# EAGLE design RGB_POI_STICK (EAGLE 5.11)

## Sheet 1 of 3
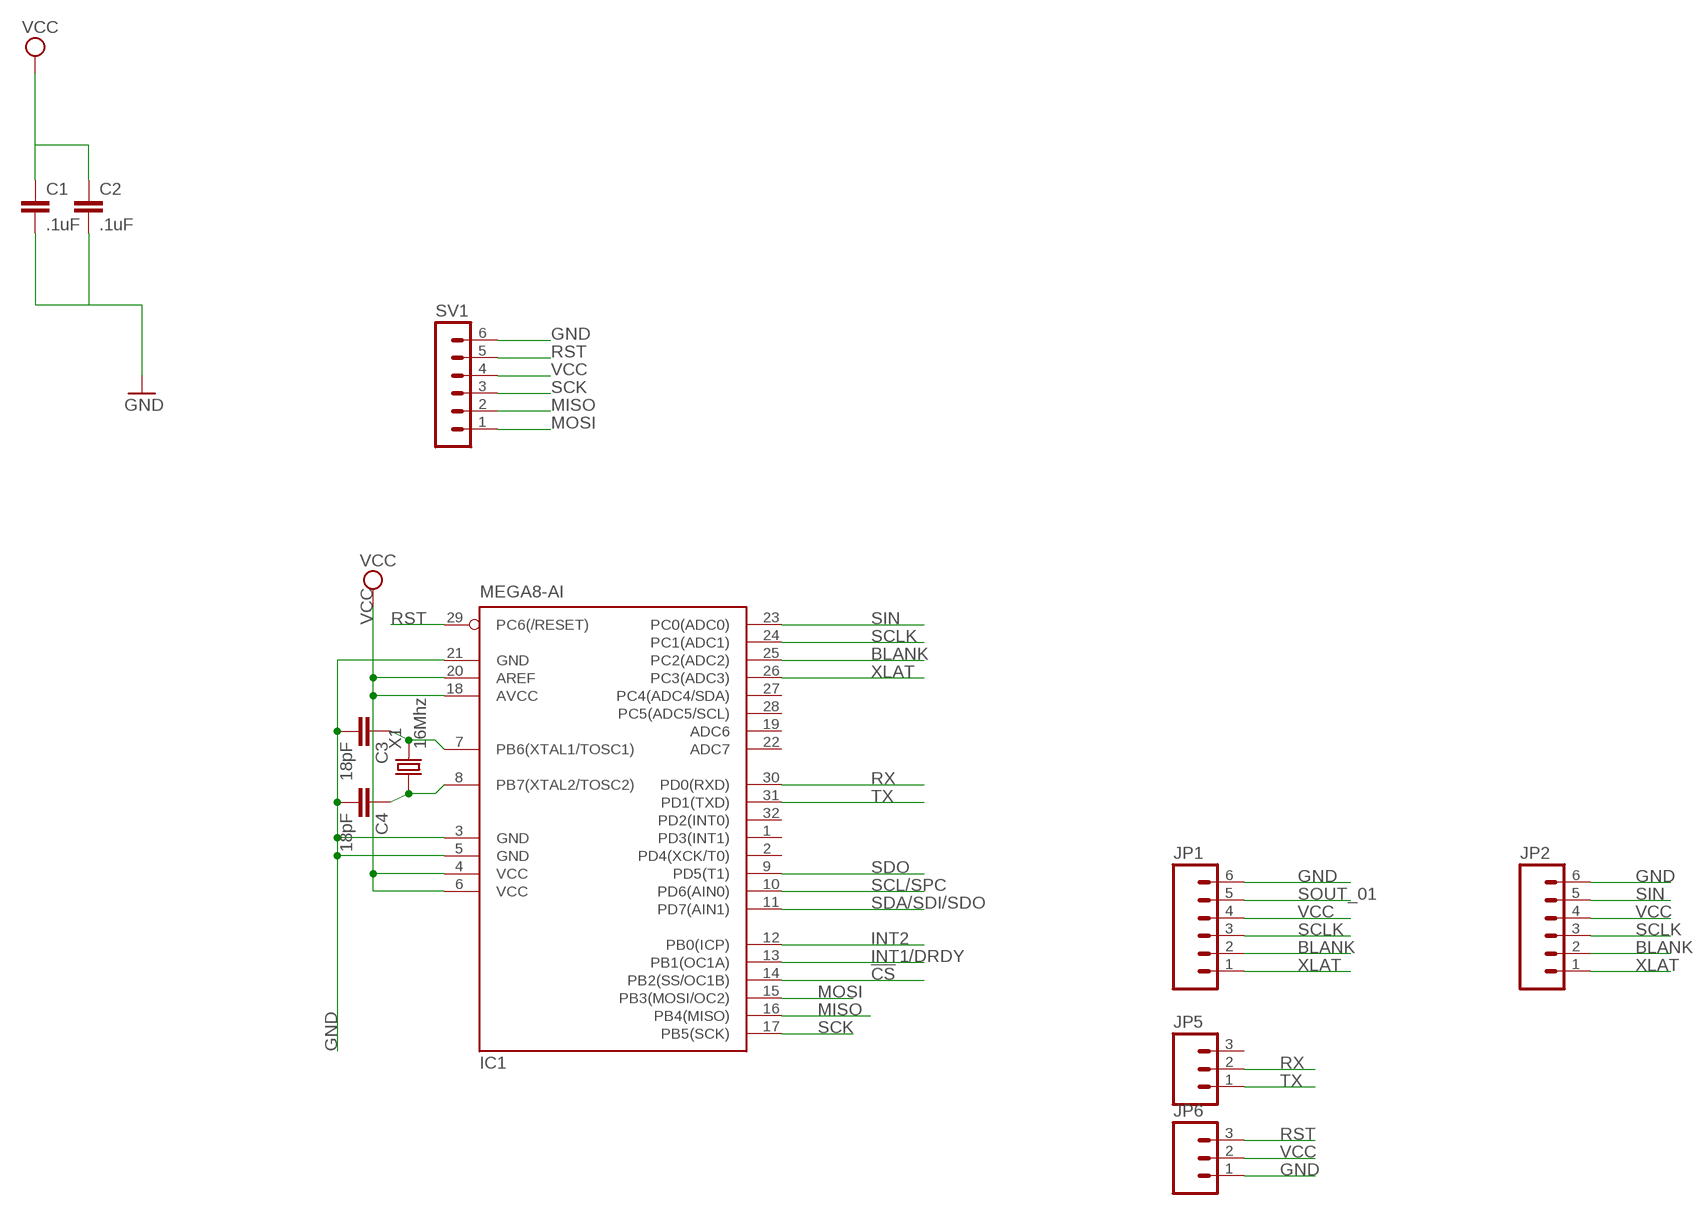
[diagram p0: schematic, sheet 1]

### Parts
C1  .1uF  CAP0805  [0805]
C2  .1uF  CAP0805  [0805]
C3  18pF  CAP0805  [0805]
C4  18pF  CAP0805  [0805]
IC1  MEGA8-AI  [TQFP32-08]
JP1  M06SIP  [1X06]
JP2  M06SIP  [1X06]
JP5  M03PTH  [1X03]
JP6  M03PTH  [1X03]
SV1  MA06-1  [MA06-1]
X1  16Mhz  CRYSTAL-5032  [5032]

### Nets
!CS: IC1.14(PB2(SS/OC1B))
BLANK: IC1.25(PC2(ADC2)) JP1.2 JP2.2 ; also sheet 2
GND: C1.2 C2.2 C3.2 C4.2 IC1.3(GND) IC1.5(GND) IC1.21(GND) JP1.6 JP2.6 JP6.1 SV1.6 ; also sheet 2
INT1/DRDY: IC1.13(PB1(OC1A))
INT2: IC1.12(PB0(ICP))
MISO: IC1.16(PB4(MISO)) SV1.2
MOSI: IC1.15(PB3(MOSI/OC2)) SV1.1
N$7: C3.1 IC1.7(PB6(XTAL1/TOSC1)) X1.2
N$8: C4.1 IC1.8(PB7(XTAL2/TOSC2)) X1.1
RST: IC1.29(PC6(/RESET)) JP6.3 SV1.5
RX: IC1.30(PD0(RXD)) JP5.2
SCK: IC1.17(PB5(SCK)) SV1.3
SCL/SPC: IC1.10(PD6(AIN0))
SCLK: IC1.24(PC1(ADC1)) JP1.3 JP2.3 ; also sheet 2
SDA/SDI/SDO: IC1.11(PD7(AIN1))
SDO: IC1.9(PD5(T1))
SIN: IC1.23(PC0(ADC0)) JP2.5 ; also sheet 2
SOUT_01: JP1.5 ; also sheet 2
TX: IC1.31(PD1(TXD)) JP5.1
VCC: C1.1 C2.1 IC1.4(VCC) IC1.6(VCC) IC1.18(AVCC) IC1.20(AREF) JP1.4 JP2.4 JP6.2 SV1.4 ; also sheet 2,3
XLAT: IC1.26(PC3(ADC3)) JP1.1 JP2.1 ; also sheet 2
Unconnected: IC1.1(PD3(INT1)) IC1.2(PD4(XCK/T0)) IC1.19(ADC6) IC1.22(ADC7) IC1.27(PC4(ADC4/SDA)) IC1.28(PC5(ADC5/SCL)) IC1.32(PD2(INT0)) JP5.3

## Sheet 2 of 3
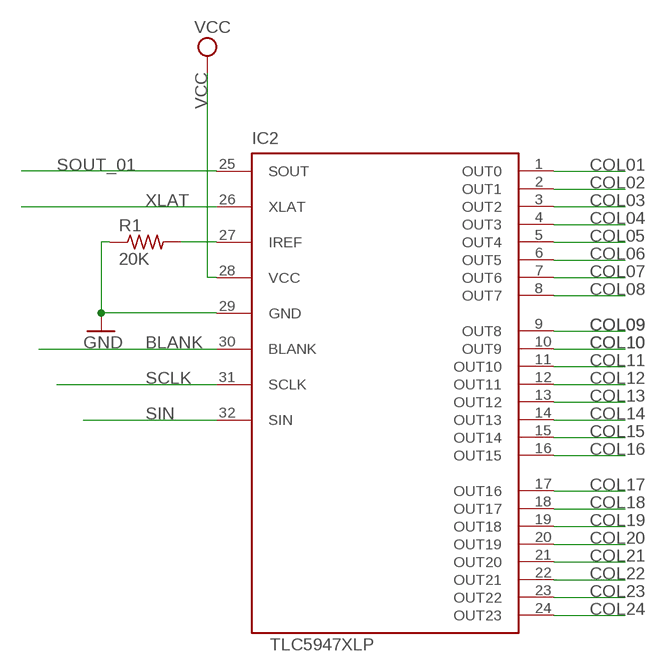
[diagram p1: schematic, sheet 2]

### Parts
IC2  TLC5947XLP  [QFN32_XLP]
R1  20K  R-US_R0805  [R0805]

### Nets
BLANK: IC2.30(BLANK) ; also sheet 1
COL01: IC2.1(OUT0) ; also sheet 3
COL02: IC2.2(OUT1) ; also sheet 3
COL03: IC2.3(OUT2) ; also sheet 3
COL04: IC2.4(OUT3) ; also sheet 3
COL05: IC2.5(OUT4) ; also sheet 3
COL06: IC2.6(OUT5) ; also sheet 3
COL07: IC2.7(OUT6) ; also sheet 3
COL08: IC2.8(OUT7) ; also sheet 3
COL09: IC2.9(OUT8) ; also sheet 3
COL10: IC2.10(OUT9) ; also sheet 3
COL11: IC2.11(OUT10) ; also sheet 3
COL12: IC2.12(OUT11) ; also sheet 3
COL13: IC2.13(OUT12) ; also sheet 3
COL14: IC2.14(OUT13) ; also sheet 3
COL15: IC2.15(OUT14) ; also sheet 3
COL16: IC2.16(OUT15) ; also sheet 3
COL17: IC2.17(OUT16) ; also sheet 3
COL18: IC2.18(OUT17) ; also sheet 3
COL19: IC2.19(OUT18) ; also sheet 3
COL20: IC2.20(OUT19) ; also sheet 3
COL21: IC2.21(OUT20) ; also sheet 3
COL22: IC2.22(OUT21) ; also sheet 3
COL23: IC2.23(OUT22) ; also sheet 3
COL24: IC2.24(OUT23) ; also sheet 3
GND: IC2.29(GND) R1.1 ; also sheet 1
N$1: IC2.27(IREF) R1.2
SCLK: IC2.31(SCLK) ; also sheet 1
SIN: IC2.32(SIN) ; also sheet 1
SOUT_01: IC2.25(SOUT) ; also sheet 1
VCC: IC2.28(VCC) ; also sheet 1,3
XLAT: IC2.26(XLAT) ; also sheet 1

## Sheet 3 of 3
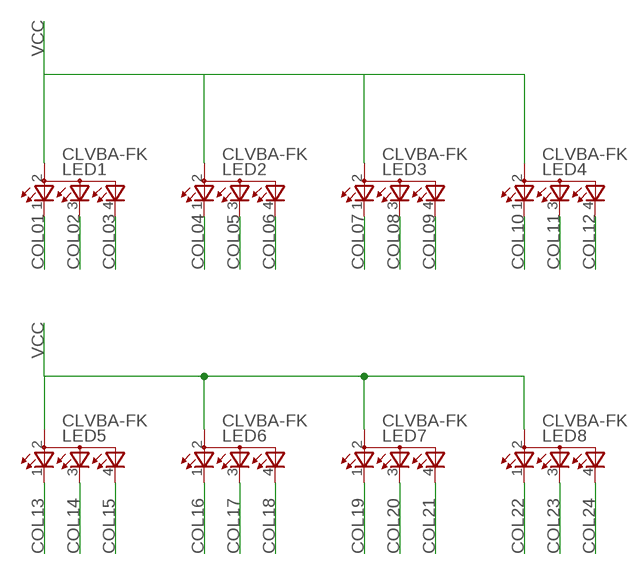
[diagram p2: schematic, sheet 3]

### Parts
LED1  CLVBA-FK  [PLCC4]
LED2  CLVBA-FK  [PLCC4]
LED3  CLVBA-FK  [PLCC4]
LED4  CLVBA-FK  [PLCC4]
LED5  CLVBA-FK  [PLCC4]
LED6  CLVBA-FK  [PLCC4]
LED7  CLVBA-FK  [PLCC4]
LED8  CLVBA-FK  [PLCC4]

### Nets
COL01: LED1.1(CRED) ; also sheet 2
COL02: LED1.3(CBLUE) ; also sheet 2
COL03: LED1.4(CGREEN) ; also sheet 2
COL04: LED2.1(CRED) ; also sheet 2
COL05: LED2.3(CBLUE) ; also sheet 2
COL06: LED2.4(CGREEN) ; also sheet 2
COL07: LED3.1(CRED) ; also sheet 2
COL08: LED3.3(CBLUE) ; also sheet 2
COL09: LED3.4(CGREEN) ; also sheet 2
COL10: LED4.1(CRED) ; also sheet 2
COL11: LED4.3(CBLUE) ; also sheet 2
COL12: LED4.4(CGREEN) ; also sheet 2
COL13: LED5.1(CRED) ; also sheet 2
COL14: LED5.3(CBLUE) ; also sheet 2
COL15: LED5.4(CGREEN) ; also sheet 2
COL16: LED6.1(CRED) ; also sheet 2
COL17: LED6.3(CBLUE) ; also sheet 2
COL18: LED6.4(CGREEN) ; also sheet 2
COL19: LED7.1(CRED) ; also sheet 2
COL20: LED7.3(CBLUE) ; also sheet 2
COL21: LED7.4(CGREEN) ; also sheet 2
COL22: LED8.1(CRED) ; also sheet 2
COL23: LED8.3(CBLUE) ; also sheet 2
COL24: LED8.4(CGREEN) ; also sheet 2
VCC: LED1.2(A2) LED2.2(A2) LED3.2(A2) LED4.2(A2) LED5.2(A2) LED6.2(A2) LED7.2(A2) LED8.2(A2) ; also sheet 1,2

## Library data of the parts
C1-C4 = slice_noshift:CAP: Capacitor Standard 0603 ceramic capacitor, and 0.1" leaded capacitor.
IC1 = atmel:MEGA8: MICROCONTROLLER 8 Kbytes FLASH, 1 kbytes SRAM, 512 bytes EEPROM, USART, 6-channel 10 bit ADC, 2-channel 8 bit ADC Pin compatible with Atmega48, ATMega88, ATMega168 Source: avr.lbr; MPN: ATMEGA8-16AU; OC_FARNELL: 9171371; OC_NEWARK: 73M8863
IC2 = slice_noshift:TLC5947
JP1 JP2 = SparkFun:M06: Header 6 Standard 6-pin 0.1" header. Use with straight break away headers (SKU : PRT-00116), right angle break away headers (PRT-00553), swiss pins (PRT-00743), machine pins (PRT-00117), and female headers (PRT-00115). Molex polarized connector foot print use with SKU : PRT-08094 with associated crimp pins and housings. NOTES ON THE VARIANTS LOCK and LOCK_LONGPADS... This footprint was designed to help hold the alignment of a through-hole component (i.e. 6-pin header) while soldering it into place. You may notice that each hole has been shifted either up or down by 0.005 of an inch from it's more standard position (which is a perfectly straight line). This slight alteration caused the pins (the squares in the middle) to touch the edges of the holes. Because they are alternating, it causes a "brace" to hold the component in place. 0.005 has proven to be the perfect amount of "off-center" position when using our standard breakaway headers. Although looks a little odd when you look at the bare footprint, once you have a header in there, the alteration is very hard to notice. Also, if you push a header all the way into place, it is covered up entirely on the bottom side. This idea of altering the position of holes to aid alignment will be further integrated into the Sparkfun Library for other footprints. It can help hold any component with 3 or more connection pins.
JP5 JP6 = SparkFun:M03: Header 3 Standard 3-pin 0.1" header. Use with straight break away headers (SKU : PRT-00116), right angle break away headers (PRT-00553), swiss pins (PRT-00743), machine pins (PRT-00117), and female headers (PRT-00115). Molex polarized connector foot print use with SKU : PRT-08232 with associated crimp pins and housings.
LED1-LED8 = rf_blinky:CLVBA-FK
R1 = rcl:R-US_: RESISTOR, American symbol
SV1 = NSL:MA06-1: PIN HEADER
X1 = NSL_MiniQuad:CRYSTAL*: CRYSTAL

## Board
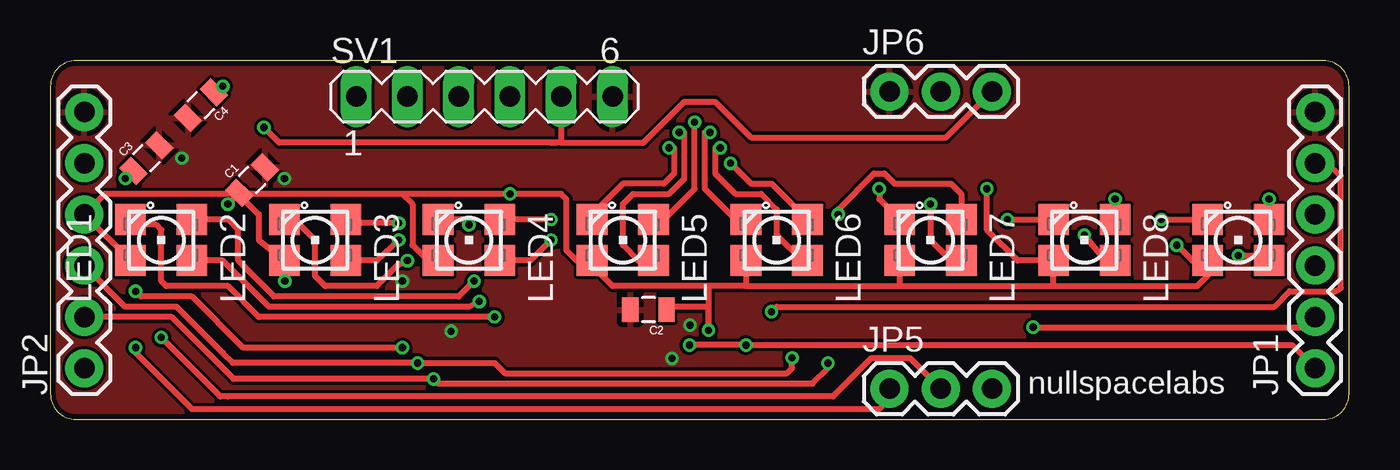
[diagram p3: board, top side]
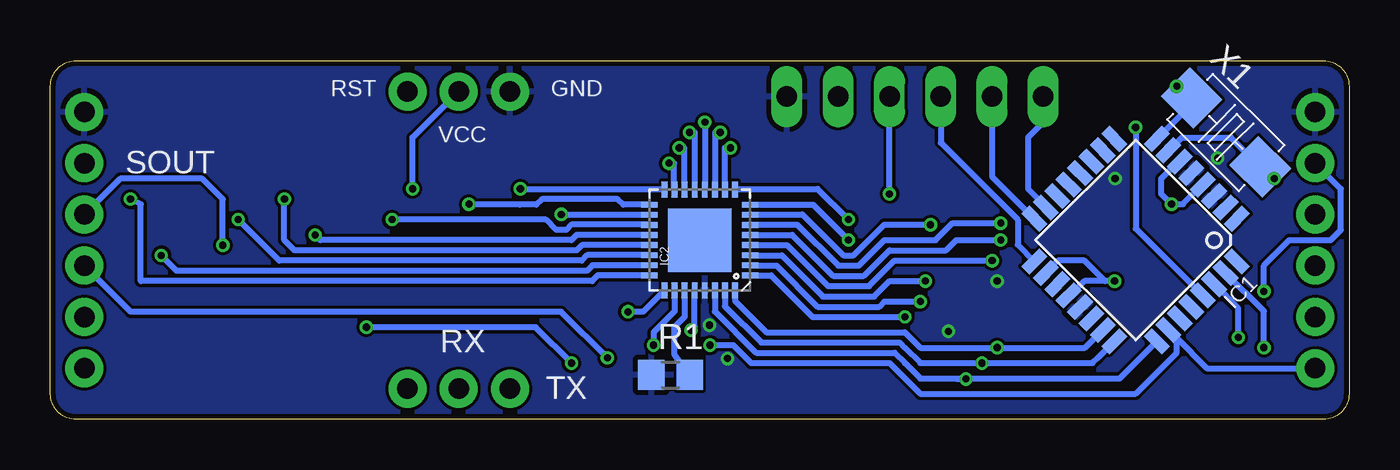
[diagram p4: board, bottom side, seen from below]

Size 64.31 x 17.78 mm. Coordinates in mm from the lower left corner, seen from the top.
Outline: 64.31,16.51 arc90 63.04,17.78 1.27,17.78 arc90 0,16.51 0,1.27 arc90 1.27,0 63.04,0 arc90 64.31,1.27 64.31,16.51
Copper layers (1*16): Top 0.035mm / dielectric 1.5mm / Bottom 0.035mm
Design rules "ITead_rule": minimum track width 6mil, minimum drill 12mil, track to track 6mil, track to pad 6mil, pad to pad 6mil, via to via 6mil, smd to smd 0mil, copper to edge 10mil, drill to drill 10mil, minimum pad ring 10mil, minimum via ring 6mil, stop-mask expansion 2mil, vias tented up to drill 100mil, thermal gap 10mil

### Footprints (pad centres in the part's own frame; a part is rotated, then mirrored left to right if it is on the bottom)
0805 = smd 0.8 x 1.2: 1 -0.9,0; 2 0.9,0
TQFP32-08 = smd 1.27 x 0.559: 1 -4.293,2.8; 2 -4.293,2; 3 -4.293,1.2; 4 -4.293,0.4; 5 -4.293,-0.4; 6 -4.293,-1.2; 7 -4.293,-2; 8 -4.293,-2.8; 17 4.293,-2.8; 18 4.293,-2; 19 4.293,-1.2; 20 4.293,-0.4; 21 4.293,0.4; 22 4.293,1.2; 23 4.293,2; 24 4.293,2.8 | smd 0.559 x 1.27: 9 -2.8,-4.293; 10 -2,-4.293; 11 -1.2,-4.293; 12 -0.4,-4.293; 13 0.4,-4.293; 14 1.2,-4.293; 15 2,-4.293; 16 2.8,-4.293; 25 2.8,4.293; 26 2,4.293; 27 1.2,4.293; 28 0.4,4.293; 29 -0.4,4.293; 30 -1.2,4.293; 31 -2,4.293; 32 -2.8,4.293
QFN32_XLP = smd 0.285 x 0.8: 1 -1.75,-2.5; 2 -1.25,-2.5; 3 -0.75,-2.5; 4 -0.25,-2.5; 5 0.25,-2.5; 6 0.75,-2.5; 7 1.25,-2.5; 8 1.75,-2.5; 17 1.75,2.5; 18 1.25,2.5; 19 0.75,2.5; 20 0.25,2.5; 21 -0.25,2.5; 22 -0.75,2.5; 23 -1.25,2.5; 24 -1.75,2.5 | smd 0.8 x 0.285: 9 2.5,-1.75; 10 2.5,-1.25; 11 2.5,-0.75; 12 2.5,-0.25; 13 2.5,0.25; 14 2.5,0.75; 15 2.5,1.25; 16 2.5,1.75; 25 -2.5,1.75; 26 -2.5,1.25; 27 -2.5,0.75; 28 -2.5,0.25; 29 -2.5,-0.25; 30 -2.5,-0.75; 31 -2.5,-1.25; 32 -2.5,-1.75 | smd 3.15 x 3.15: EP 0,0
1X06 = drill 1.016 pad 1.88 round: 1 0,0; 2 2.54,0; 3 5.08,0; 4 7.62,0; 5 10.16,0; 6 12.7,0
1X03 = drill 1.016 pad 1.88 round: 1 0,0; 2 2.54,0; 3 5.08,0
PLCC4 = smd 1.524 x 1.524: 1 -1.524,1.016; 2 -1.524,-1.016; 3 1.524,-1.016; 4 1.524,1.016
R0805 = smd 1.3 x 1.5: 1 -0.95,0; 2 0.95,0
MA06-1 = drill 1.016 long: 1 -6.35,0; 2 -3.81,0; 3 -1.27,0; 4 1.27,0; 5 3.81,0; 6 6.35,0
5032 = smd 2.286 x 2.032: 1 -2.413,0; 2 2.413,0

### Placement (x,y rotation side)
C1  9.98,11.86 45 top
C2  29.62,5.44 180 top
C3  4.75,12.95 45 top
C4  7.45,15.58 225 top
IC1  10.57,8.89 225 bottom
IC2  32.16,8.89 90 bottom
JP1  62.64,2.54 90 top
JP2  1.68,2.54 90 top
JP5  41.55,1.52 0 top
JP6  41.55,16.26 0 top
LED1  5.49,8.89 0 top
LED2  13.11,8.89 0 top
LED3  20.73,8.89 0 top
LED4  28.35,8.89 0 top
LED5  35.97,8.89 0 top
LED6  43.59,8.89 0 top
LED7  51.21,8.89 0 top
LED8  58.83,8.89 0 top
R1  33.61,2.21 0 bottom
SV1  21.49,16 0 top
X1  6.1,14.22 315 bottom

### Tracks (layer width: path | path; a pad name or v marks a point on that pad's centre or on a via)
BLANK  (via drill 0.36)
  Top 0.305: JP2.2 5.99,5.08 9.07,2.01 v18.97,2.01 19.2,1.78 37.74,1.78 38.51,2.54 v38.51,2.79 | JP1.2 62.89,5.08 62.38,4.57 v48.67,4.57
  Bottom 0.305: IC2.30 31.41,5.35 29.36,3.3 22.5,3.3 22,2.79 21.23,2.03 19.46,2.03 | 9.51,3.85 IC1.25 11.35,2.03 18.44,2.03 19.46,2.03 | v38.51,2.79 40.28,4.57 v48.67,4.57 | 19.46,2.03 19.43,2.01 v18.97,2.01
COL01  (via drill 0.36)
  Top 0.305: v22,5.08 10.31,5.08 8.79,6.6 5.74,6.6 5.49,6.86 5.49,9.4 5.23,9.65 4.22,9.65 LED1.1
  Bottom 0.305: IC2.1 28.63,7.14 26.57,5.08 v22,5.08
COL02  (via drill 0.36)
  Top 0.305: v21.23,5.84 20.73,5.59 10.82,5.59 8.53,7.87 LED1.3
  Bottom 0.305: IC2.2 29.64,7.62 28.35,7.62 26.31,5.59 23.27,5.59 23.01,5.84 v21.23,5.84
COL03  (via drill 0.36)
  Top 0.305: v20.98,6.86 20.22,6.1 11.07,6.1 9.3,7.87 9.3,9.4 8.79,9.91 LED1.4
  Bottom 0.305: IC2.3 29.64,8.13 28.09,8.13 26.06,6.1 23.52,6.1 22.76,6.86 v20.98,6.86
COL04  (via drill 0.36)
  Top 0.305: LED2.1 12.09,9.91 13.11,8.89 13.11,7.37 13.11,7.11 13.61,6.6 16.15,6.6 17.17,7.62 v17.68,7.87
  Bottom 0.305: IC2.4 27.84,8.64 25.81,6.6 23.77,6.6 22.5,7.87 v17.68,7.87
COL05  (via drill 0.36)
  Top 0.305: v17.25,8.89 16.15,7.87 LED2.3
  Bottom 0.305: IC2.5 27.58,9.14 25.55,7.11 24.03,7.11 22.76,8.38 19.96,8.38 19.46,8.89 v17.25,8.89
COL06  (via drill 0.36)
  Top 0.305: LED2.4 14.81,9.73 v17.25,9.73
  Bottom 0.305: IC2.6 29.64,9.65 27.33,9.65 25.3,7.62 24.28,7.62 23.01,8.89 20.47,8.89 19.63,9.73 v17.25,9.73
COL07  (via drill 0.36)
  Top 0.305: v20.73,9.65 20.47,9.91 LED3.1
  Bottom 0.305: IC2.7 29.64,10.16 27.08,10.16 25.04,8.13 24.54,8.13 23.01,9.65 v20.73,9.65
COL08  (via drill 0.36)
  Top 0.305: v24.79,8.89 23.77,7.87 LED3.3
  Bottom 0.305: IC2.8 26.54,10.64 v24.79,8.89
COL09  (via drill 0.36)
  Top 0.305: v24.79,9.91 LED3.4
  Bottom 0.305: v24.79,9.91 26.31,11.43 30.37,11.43 IC2.9
COL10  (via drill 0.36)
  Top 0.305: v30.63,13.46 30.89,13.46 30.89,12.19 30.38,11.68 28.35,11.68 26.82,10.16 LED4.1
  Bottom 0.305: IC2.10 30.91,13.46 v30.63,13.46
COL11  (via drill 0.36)
  Top 0.305: v31.14,14.22 31.39,14.22 31.39,11.94 30.63,11.18 28.85,11.18 28.35,10.67 28.35,8.64 29.11,7.87 LED4.3
  Bottom 0.305: IC2.11 31.39,11.4 31.39,14.22 v31.14,14.22
COL12  (via drill 0.36)
  Top 0.305: v31.9,14.73 31.9,11.43 30.38,9.91 LED4.4
  Bottom 0.305: IC2.12 v31.9,14.73
COL13  (via drill 0.36)
  Top 0.305: v32.66,14.22 32.41,14.22 32.41,11.43 33.93,9.91 LED5.1
  Bottom 0.305: IC2.13 32.41,14.22 v32.66,14.22
COL14  (via drill 0.36)
  Top 0.305: v33.17,13.46 32.92,13.46 32.92,12.19 33.93,11.18 35.2,11.18 35.97,10.41 35.97,9.14 37.24,7.87 LED5.3
  Bottom 0.305: IC2.14 32.92,11.4 32.92,13.46 v33.17,13.46
COL15  (via drill 0.36)
  Top 0.305: LED5.4 35.71,11.68 34.7,11.68 v33.68,12.7
  Bottom 0.305: IC2.15 33.43,11.41 33.43,12.7 v33.68,12.7
COL16  (via drill 0.36)
  Top 0.305: v41.05,11.43 41.05,10.92 LED6.1
  Bottom 0.305: IC2.16 41.01,11.39 v41.05,11.43
COL17  (via drill 0.36)
  Top 0.305: 44.86,8.13 LED6.3 44.6,7.87 43.59,8.89 v43.59,10.67
  Bottom 0.305: v43.59,10.67 43.56,10.64 41.07,10.64 40.26,10.64 39.97,10.92 36.22,10.92 35.94,10.64 IC2.17
COL18  (via drill 0.36)
  Top 0.305: v39.01,10.16 39.01,10.41 40.79,12.19 41.3,12.19 41.81,11.68 44.6,11.68 45.11,11.18 LED6.4
  Bottom 0.305: IC2.18 38.99,10.14 v39.01,10.16
COL19  (via drill 0.36)
  Top 0.305: v47.4,9.91 LED7.1
  Bottom 0.305: IC2.19 34.67,9.65 38.51,9.65 38.76,9.4 39.27,9.4 39.78,9.91 v47.4,9.91
COL20  (via drill 0.36)
  Top 0.305: v51.21,9.14 52.22,7.87 LED7.3
  Bottom 0.305: IC2.20 38.25,9.14 38.51,8.89 50.95,8.89 v51.21,9.14
COL21  (via drill 0.36)
  Top 0.305: v52.73,10.92 LED7.4
  Bottom 0.305: IC2.21 38,8.64 38.25,8.38 50.7,8.38 52.22,8.38 52.73,8.89 v52.73,10.92
COL22  (via drill 0.36)
  Top 0.305: v55.02,9.91 LED8.1
  Bottom 0.305: IC2.22 37.73,8.14 38,7.87 52.98,7.87 v55.02,9.91
COL23  (via drill 0.36)
  Top 0.305: v58.83,8.13 60.1,8.13 LED8.3
  Bottom 0.305: IC2.23 37.47,7.64 37.74,7.37 58.06,7.37 v58.83,8.13
COL24  (via drill 0.36)
  Top 0.305: v60.35,10.92 LED8.4
  Bottom 0.305: IC2.24 37.21,7.14 37.49,6.86 59.84,6.86 59.84,10.67 v60.35,10.92
GND  (via drill 0.36)
  other vias: 31.67,4.67 17.42,6.86 11.58,11.94 6.5,12.95 19.84,4.37 30.78,3.02
  pour Bottom: -1.37,19.05 64.92,19.3 64.92,-1.02 -1.37,-1.27
  pour Top: -0.36,18.29 64.67,18.29 64.67,-0.25 -0.36,-0.25
MISO
  Bottom 0.305: IC1.16 17.68,12.04 SV1.2
MOSI
  Bottom 0.305: IC1.15 15.02,10.55 15.9,11.43 15.9,13.97 15.14,14.73 SV1.1
N$1
  Bottom 0.305: IC2.27 | IC2.27 32.92,6.38 | IC2.27 32.91,5.09 33.43,4.57 33.43,3.3 33.43,3.24 R1.2
N$7  (via drill 0.36)
  Top 0.305: C3.1 4.09,12.32 v3.71,11.94
  Bottom 0.305: IC1.7 8.91,13.34 8.28,13.97 5.85,13.97 X1.2 3.81,11.94 v3.71,11.94
N$8  (via drill 0.36)
  Top 0.305: C4.1 8.24,16.22 v8.53,16.51
  Bottom 0.305: IC1.8 7.81,15.61 X1.1 8.39,16.51 v8.53,16.51
RST  (via drill 0.36)
  Top 0.305: v10.57,14.48 11.33,13.72 24.79,13.72 | 24.79,13.72 25.04,13.72 | JP6.3 44.35,13.97 34.7,13.97 32.92,15.75 31.39,15.75 29.36,13.72 25.3,13.72 | 25.3,13.72 24.79,13.72 | SV1.5 25.3,13.72
  Bottom 0.305: IC1.29 10.57,9.46 v10.57,14.48
RX  (via drill 0.36)
  Top 0.305: JP5.2 42.57,3.05 40.67,3.05 38.76,1.14 8.79,1.14 8.41,1.14 v5.49,4.06
  Bottom 0.305: IC1.30 5.49,5.51 v5.49,4.06
SCK
  Bottom 0.305: IC1.17 16.41,8.66 16.41,9.91 20.22,13.72 SV1.3
SCLK  (via drill 0.36)
  Top 0.305: JP2.3 3.71,5.59 6.25,5.59 8.53,3.3 9.04,2.79 v18.19,2.79 22,2.79 22.5,2.29 36.47,2.29 36.73,2.54 v36.73,3.05
  Bottom 0.305: IC2.31 30.91,5.61 30.89,5.59 29.11,3.81 22.25,3.81 22,3.56 21.23,2.79 v18.19,2.79 12.7,2.79 12.45,3.05 IC1.24 | JP1.3 60.35,5.33 39.01,5.33 v36.73,3.05
SIN  (via drill 0.36)
  Top 0.305: v4.22,6.35 4.47,6.1 7.01,6.1 9.55,3.56 v17.42,3.56
  Bottom 0.305: IC2.32 30.41,5.87 30.38,5.84 28.85,4.32 22,4.32 21.23,3.56 v17.42,3.56 13.07,3.56 IC1.23 | JP2.5 0.41,11.43 0.41,9.4 0.91,8.89 2.95,8.89 4.22,7.62 v4.22,6.35
SOUT_01  (via drill 0.36)
  Top 0.305: v35.71,5.33 35.97,5.59 60.6,5.59 61.37,6.35 63.65,6.35 63.91,6.53 63.91,12.07 63.25,12.7 JP1.5
  Bottom 0.305: IC2.25 34.96,5.33 v35.71,5.33
TX  (via drill 0.36)
  Top 0.305: v4.22,3.56 4.22,3.3 7.01,0.51 41.05,0.51 41.55,1.02 JP5.1
  Bottom 0.305: IC1.31 4.22,5.37 v4.22,3.56
VCC  (via drill 0.36)
  Top 0.305: LED1.2 JP2.4 2.69,11.18 9.3,11.18 | 9.3,11.18 10.31,10.16 10.31,8.89 LED2.2 v11.61,6.86 | 17.42,11.18 9.3,11.18 | 17.42,11.18 17.93,10.67 | 17.93,10.67 17.93,8.64 18.69,7.87 LED3.2 | 17.42,11.18 17.93,10.67 | 17.42,11.18 v22.76,11.18 25.3,11.18 25.55,10.92 25.55,8.38 26.06,7.87 LED4.2 26.82,7.62 27.84,6.6 34.44,6.6 | 9.3,11.18 C1.1 | v8.79,10.67 | C1.1 v8.79,10.67 | C1.1 9.55,11.43 | 34.44,6.6 42.06,6.6 | 42.06,6.6 49.68,6.6 | 49.68,6.6 56.79,6.6 57.3,7.11 LED8.2 56.54,7.87 v55.78,8.64 | LED5.2 34.44,6.6 | 34.44,6.6 32.59,6.6 v32.59,4.42 32.59,5.59 30.67,5.59 C2.1 | 42.06,6.6 LED6.2 | 49.68,6.6 LED7.2 47.9,7.87 46.38,9.4 v46.38,11.43
  Bottom 0.305: IC2.28 32.41,4.6 v32.59,4.42 | IC1.4 8.22,10.67 v8.79,10.67 9.3,11.18 9.3,11.94 8.46,12.77 | 8.46,12.77 IC1.6 8.46,12.77 | v22.76,11.18 SV1.4 | v55.78,8.64 55.78,10.92 56.29,11.43 56.79,11.94 60.86,11.94 JP1.4 | IC1.20 13.83,6.14 13.11,6.86 v11.61,6.86 12.09,6.86 13.11,7.87 14.41,7.87 IC1.18 | v46.38,11.43 46.38,13.97 JP6.2
XLAT  (via drill 0.36)
  Top 0.305: v31.65,3.68 v34.44,3.68 61.49,3.68 JP1.1
  Bottom 0.305: IC2.26 33.41,5.35 34.44,4.32 v34.44,3.68 | 8.53,4.03 8.53,3.3 10.57,1.27 21.23,1.27 22.25,2.29 22.76,2.79 29.62,2.79 30.51,3.68 v31.65,3.68 | 8.53,4.03 IC1.26 | JP2.1 7.04,2.54 8.53,4.03

### Text on the board
tPlace: nullspacelabs
bPlace: GND | RST | VCC | SOUT | RX | TX